# EAGLE design PIC18F2550 BOARD (EAGLE 7.1.0)
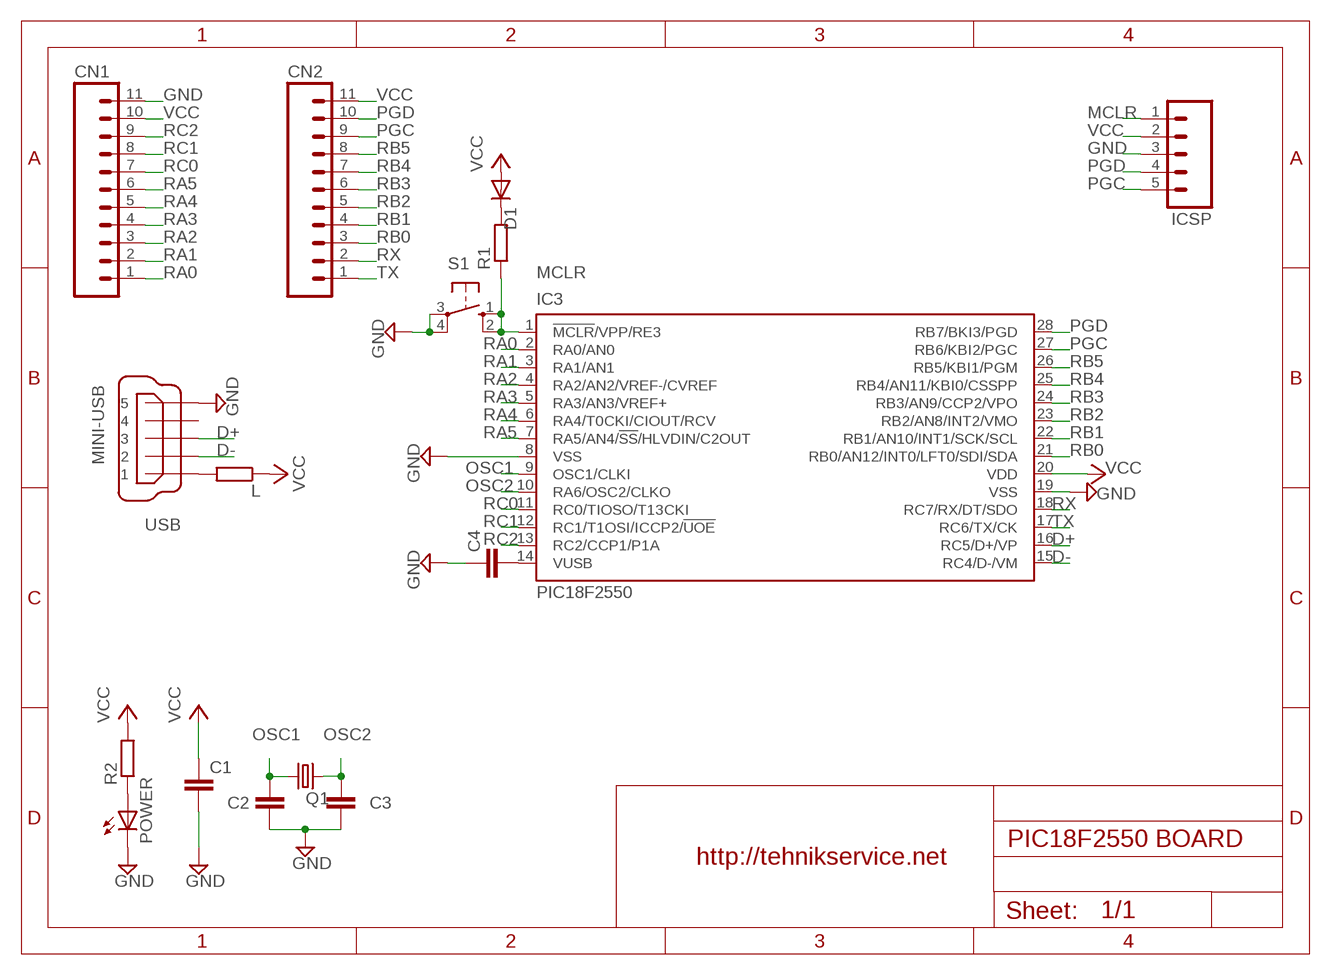
[diagram p0: schematic, sheet 1]

## Parts
C1  C-EUC0402  [C0402]
C2  C-EUC0402  [C0402]
C3  C-EUC0402  [C0402]
C4  C-EUC0402  [C0402]
CN1  M11  [11P]
CN2  M11  [11P]
D1  DIODE-DO214AC  [DO214AC]
IC3  PIC18F2550  PIC18F2550_28W  [SO28W]
ICSP  M05  [05P]
L  R-EU_R0402  [R0402]
POWER  LEDCHIP-LED0805  [CHIP-LED0805]
Q1  CRYSTALHC49S  [HC49/S]
R1  R-EU_R0402  [R0402]
R2  R-EU_R0402  [R0402]
S1  10-XX  [B3F-10XX]
USB  MINI-USB  MINI-USB-32005-201  [32005-201]

## Nets
D+: IC3.16(RC5/D+/VP) USB.3
D-: IC3.15(RC4/D-/VM) USB.2
GND: C1.2 C2.2 C3.2 C4.1 CN1.11 IC3.8(VSS) IC3.19(VSS) ICSP.3 POWER.C S1.3(P) S1.4(P1) USB.5
MCLR: IC3.1(!MCLR!/VPP/RE3) ICSP.1 R1.1 S1.1(S) S1.2(S1)
N$1: D1.C R1.2
N$2: POWER.A R2.1
N$3: C4.2 IC3.14(VUSB)
N$4: L.2 USB.1
OSC1: C2.1 IC3.9(OSC1/CLKI) Q1.1
OSC2: C3.1 IC3.10(RA6/OSC2/CLKO) Q1.2
PGC: CN2.9 IC3.27(RB6/KBI2/PGC) ICSP.5
PGD: CN2.10 IC3.28(RB7/BKI3/PGD) ICSP.4
RA0: CN1.1 IC3.2(RA0/AN0)
RA1: CN1.2 IC3.3(RA1/AN1)
RA2: CN1.3 IC3.4(RA2/AN2/VREF-/CVREF)
RA3: CN1.4 IC3.5(RA3/AN3/VREF+)
RA4: CN1.5 IC3.6(RA4/T0CKI/CIOUT/RCV)
RA5: CN1.6 IC3.7(RA5/AN4/!SS!/HLVDIN/C2OUT)
RB0: CN2.3 IC3.21(RB0/AN12/INT0/LFT0/SDI/SDA)
RB1: CN2.4 IC3.22(RB1/AN10/INT1/SCK/SCL)
RB2: CN2.5 IC3.23(RB2/AN8/INT2/VMO)
RB3: CN2.6 IC3.24(RB3/AN9/CCP2/VPO)
RB4: CN2.7 IC3.25(RB4/AN11/KBI0/CSSPP)
RB5: CN2.8 IC3.26(RB5/KBI1/PGM)
RC0: CN1.7 IC3.11(RC0/TIOSO/T13CKI)
RC1: CN1.8 IC3.12(RC1/T1OSI/ICCP2/!UOE)
RC2: CN1.9 IC3.13(RC2/CCP1/P1A)
RX: CN2.2 IC3.18(RC7/RX/DT/SDO)
TX: CN2.1 IC3.17(RC6/TX/CK)
VCC: C1.1 CN1.10 CN2.11 D1.A IC3.20(VDD) ICSP.2 L.1 R2.2
Unconnected: USB.4

## Notes on the sheet
- http://tehnikservice.net

## Library data of the parts
C1-C4 = rcl:C-EU: CAPACITOR, European symbol
CN1 CN2 = con-amp-quick:M11: AMP QUICK CONNECTOR; OC_FARNELL: unknown; OC_NEWARK: unknown
D1 = diode:DIODE-: DIODE
IC3 = microchip:PIC18F2*_28: USB Microcontrollers with nanoWatt Technology High-Performance, Enhanced Flash, 28/40/44-Pin, Source: http://ww1.microchip.com/downloads/en/devicedoc/39632c.pdf; MF: MICROCHIP; MPN: PIC18F2550-I/SO; OC_FARNELL: 9321268; OC_NEWARK: 73K1297
ICSP = con-amp-quick:M05: AMP QUICK CONNECTOR; OC_FARNELL: unknown; OC_NEWARK: unknown
L R1 R2 = rcl:R-EU_: RESISTOR, European symbol
POWER = led:LED: LED OSRAM: - CHIPLED LG R971, LG N971, LY N971, LG Q971, LY Q971, LO R971, LY R971 LH N974, LH R974 LS Q976, LO Q976, LY Q976 LO Q996 - Hyper CHIPLED LW Q18S LB Q993, LB Q99A, LB R99A - SideLED LS A670, LO A670, LY A670, LG A670, LP A670 LB A673, LV A673, LT A673, LW A673 LH A674 LY A675 LS A676, LA A676, LO A676, LY A676, LW A676 LS A679, LY A679, LG A679 - Hyper Micro SIDELED® LS Y876, LA Y876, LO Y876, LY Y876 LT Y87S - SmartLED LW L88C, LW L88S LB L89C, LB L89S, LG L890 LS L89K, LO L89K, LY L89K LS L896, LA L896, LO L896, LY L896 - TOPLED LS T670, LO T670, LY T670, LG T670, LP T670 LSG T670, LSP T670, LSY T670, LOP T670, LYG T670 LG T671, LOG T671, LSG T671 LB T673, LV T673, LT T673, LW T673 LH T674 LS T676, LA T676, LO T676, LY T676, LB T676, LH T676, LSB T676, LW T676 LB T67C, LV T67C, LT T67C, LS T67K, LO T67K, LY T67K, LW E67C LS E67B, LA E67B, LO E67B, LY E67B, LB E67C, LV E67C, LT E67C LW T67C LS T679, LY T679, LG T679 LS T770, LO T770, LY T770, LG T770, LP T770 LB T773, LV T773, LT T773, LW T773 LH T774 LS E675, LA E675, LY E675, LS T675 LS T776, LA T776, LO T776, LY T776, LB T776 LHGB T686 LT T68C, LB T68C - Hyper Mini TOPLED® LB M676 - Mini TOPLED Santana® LG M470 LS M47K, LO M47K, LY M47K Source: http://www.osram.convergy.de LUXEON: - LUMILED® LXK2-PW12-R00, LXK2-PW12-S00, LXK2-PW14-U00, LXK2-PW14-V00 LXK2-PM12-R00, LXK2-PM12-S00, LXK2-PM14-U00 LXK2-PE12-Q00, LXK2-PE12-R00, LXK2-PE12-S00, LXK2-PE14-T00, LXK2-PE14-U00 LXK2-PB12-K00, LXK2-PB12-L00, LXK2-PB12-M00, LXK2-PB14-N00, LXK2-PB14-P00, LXK2-PB14-Q00 LXK2-PR12-L00, LXK2-PR12-M00, LXK2-PR14-Q00, LXK2-PR14-R00 LXK2-PD12-Q00, LXK2-PD12-R00, LXK2-PD12-S00 LXK2-PH12-R00, LXK2-PH12-S00 LXK2-PL12-P00, LXK2-PL12-Q00, LXK2-PL12-R00 Source: www.luxeon.com KINGBRIGHT: KA-3528ASYC Source: www.kingbright.com
Q1 = crystal:CRYSTAL: CRYSTAL; OC_FARNELL: 1667008; OC_NEWARK: unknown
S1 = switch-omron:10-XX: OMRON SWITCH; MPN: B3F-1000; OC_FARNELL: 176432; OC_NEWARK: 36M3542
USB = con-cypressindustries:MINI-USB-: MINI USB-B Conector Source: www.cypressindustries.com; OC_FARNELL: unknown; OC_NEWARK: unknown

## Net classes
0 default: clearance 0.355 mm

## Board
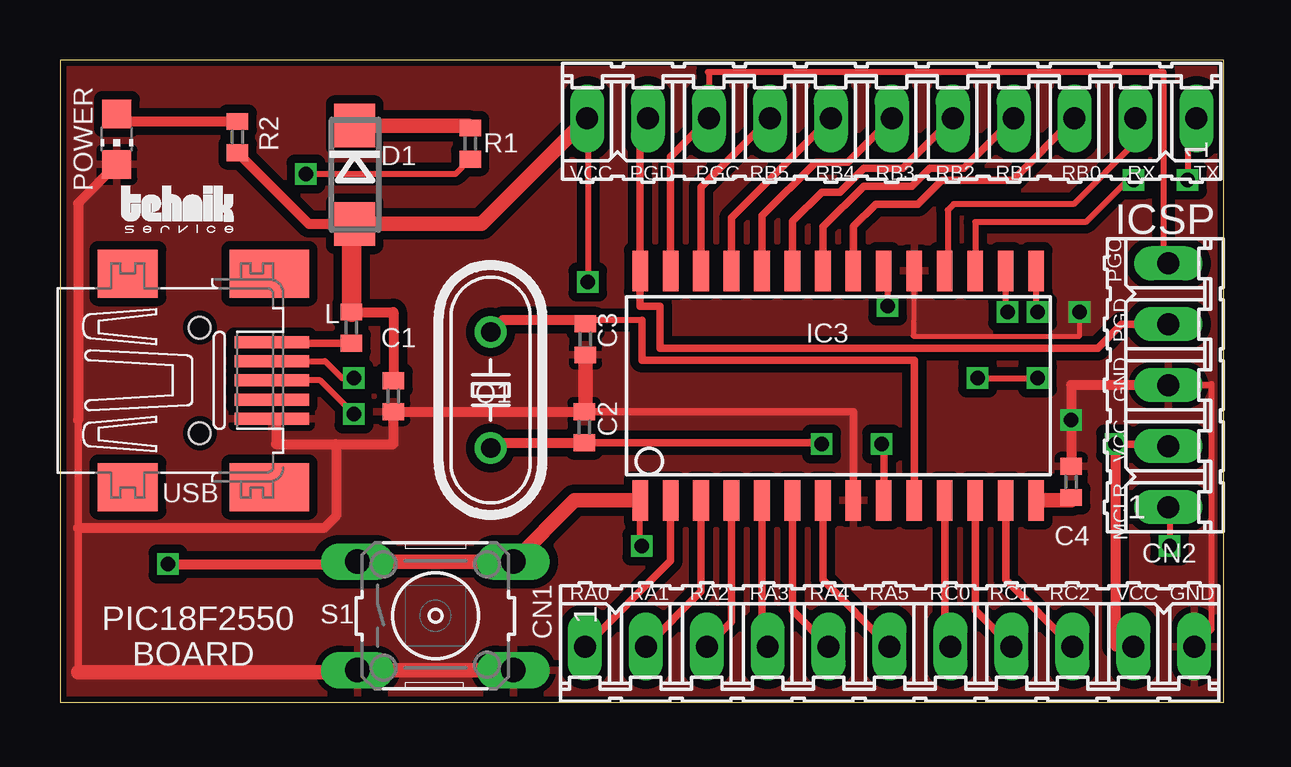
[diagram p1: board, top side]
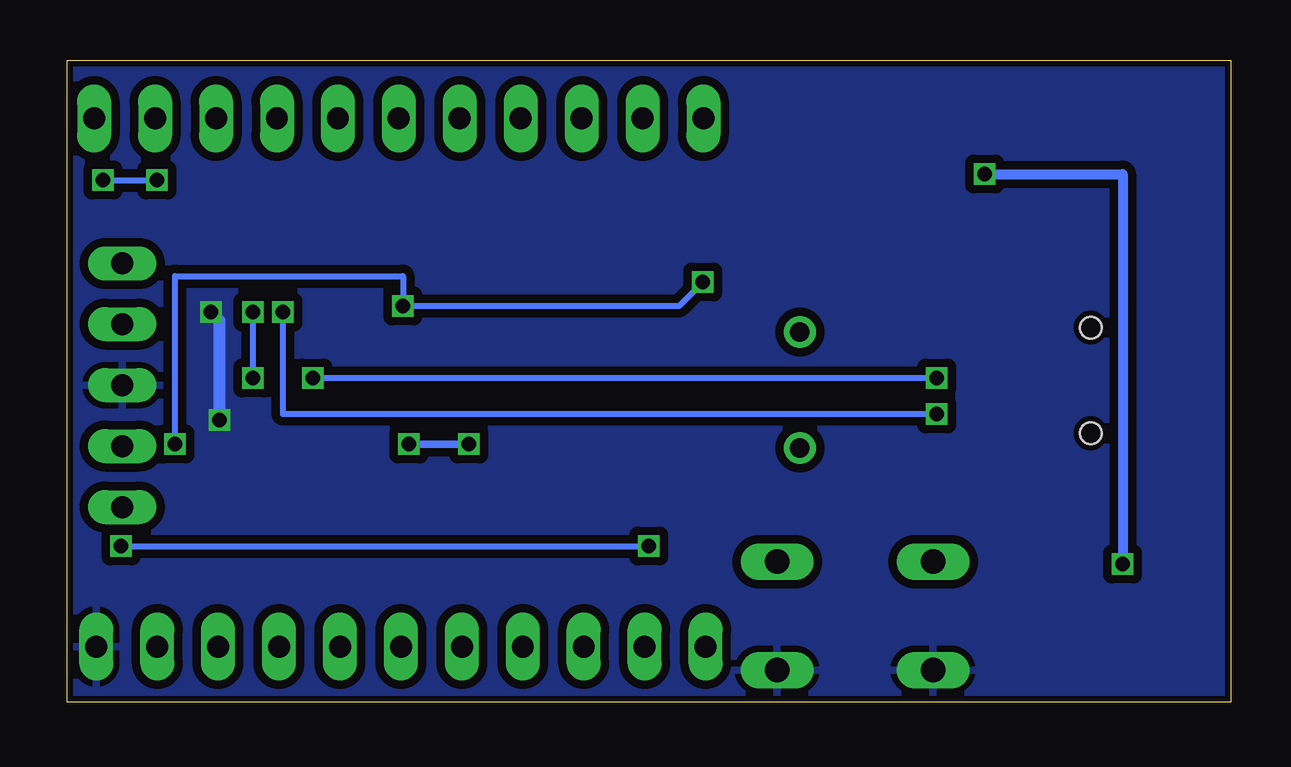
[diagram p2: board, bottom side, seen from below]

Size 48.5 x 26.75 mm. Coordinates in mm from the lower left corner, seen from the top.
Outline: 0,0 48.5,0 48.5,26.75 0,26.75 0,0
Copper layers (1*16): Top 0.035mm / dielectric 1.5mm / Bottom 0.035mm
Design rules "SeeedStudio_2layer_DRU_no_angle_20140221 *": minimum track width 6mil, minimum drill 12mil, track to track 12mil, track to pad 6mil, pad to pad 6mil, via to via 6mil, smd to smd 0mil, copper to edge 10mil, drill to drill 10mil, minimum pad ring 10mil, minimum via ring 6mil, stop-mask expansion 2mil, vias tented up to drill 100mil, thermal gap 10mil

### Footprints (pad centres in the part's own frame; a part is rotated, then mirrored left to right if it is on the bottom)
C0402 = smd 0.7 x 0.9: 1 -0.65,0; 2 0.65,0
11P = drill 0.914 long: 1 -12.7,0; 2 -10.16,0; 3 -7.62,0; 4 -5.08,0; 5 -2.54,0; 6 0,0; 7 2.54,0; 8 5.08,0; 9 7.62,0; 10 10.16,0; 11 12.7,0
DO214AC = smd 1.8 x 1.7: A 2.05,0; C -2.05,0
SO28W = smd 0.65 x 1.7: 1 -7.62,-4.78; 2 -6.35,-4.78; 3 -5.08,-4.78; 4 -3.81,-4.78; 5 -2.54,-4.78; 6 -1.27,-4.78; 7 0,-4.78; 8 1.27,-4.78; 9 2.54,-4.78; 10 3.81,-4.78; 11 5.08,-4.78; 12 6.35,-4.78; 13 7.62,-4.78; 14 8.89,-4.78; 15 8.89,4.78; 16 7.62,4.78; 17 6.35,4.78; 18 5.08,4.78; 19 3.81,4.78; 20 2.54,4.78; 21 1.27,4.78; 22 0,4.78; 23 -1.27,4.78; 24 -2.54,4.78; 25 -3.81,4.78; 26 -5.08,4.78; 27 -6.35,4.78; 28 -7.62,4.78
05P = drill 0.914 long: 1 -5.08,0; 2 -2.54,0; 3 0,0; 4 2.54,0; 5 5.08,0
R0402 = smd 0.7 x 0.9: 1 -0.65,0; 2 0.65,0
CHIP-LED0805 = smd 1.2 x 1.2: A 0,-1.05; C 0,1.05
HC49/S = drill 0.813: 1 -2.413,0; 2 2.413,0
B3F-10XX = drill 1.016 long: 1 -3.251,2.261; 2 3.251,2.261; 3 -3.251,-2.261; 4 3.251,-2.261
32005-201 = smd 3.1 x 0.5: 1 3,1.6; 2 3,0.8; 3 3,0; 4 3,-0.8; 5 3,-1.6 | smd 2.5 x 2: M1 -3,-4.45; M2 -3,4.45 | smd 3.3 x 2: M3 2.9,4.45; M4 2.9,-4.45 | hole 0.9: 0,2.2; 0,-2.2

### Placement (x,y rotation side)
C1  13.9,12.74 270 top
C2  21.85,11.45 90 top
C3  21.9,15.11 270 top
C4  42.15,9.17 270 top
CN1  34.58,2.31 0 top
CN2  34.67,24.32 180 top
D1  12.28,21.97 270 top
IC3  31.8,13.18 0 top
ICSP  46.2,13.2 90 top
L  12.15,15.6 270 top
POWER  2.37,23.45 180 top
Q1  17.95,13 90 top
R1  17.1,23.27 90 top
R2  7.4,23.54 270 top
S1  15.65,3.59 0 top
U$1  [LOGOT]  2.5,19.5 0 top
USB  5.83,13.4 0 top

### Tracks (layer width: path | path; a pad name or v marks a point on that pad's centre or on a via)
D+  (via drill 0.6)
  Top 0.254: v39.5,16.25 39.42,16.25 IC3.16 | v12.25,12 10.85,13.4 USB.3
  Bottom 0.254: v12.25,12 39.5,12 v39.5,16.25
D-  (via drill 0.6)
  Top 0.254: USB.2 11.05,14.2 11.75,13.5 v12.25,13.5 | v38.25,13.5 v40.75,13.5 | v40.75,16.25 40.69,16.25 IC3.15
  Bottom 0.254: v12.25,13.5 v38.25,13.5 | v40.75,13.5 v40.75,16.25
GND  (via drill 0.6)
  Top 0.2: IC3.19 35.57,15.25 42.5,15.25 v42.5,16.25
  Top 0.254: CN1.11 48,3.03 48,13.25 47.95,13.2 ICSP.3 | USB.5 9,11.8 9,10.75
  Top 0.305: 0.75,11.75 0.75,7.25 0.75,1.25 | C2.2 33.07,12.1 IC3.8
  Top 0.406: POWER.C 0.75,20.78 0.75,11.75 | USB.5 8.83,11.75 9,11.75 9,10.75 11.5,10.75 | 13.9,11.8 C1.2 | C1.2 C2.2 | ICSP.3 42.15,13.2 v42.15,11.75 C4.1 | 11.5,10.75 13.9,10.75 C1.2 | 11.5,10.75 11.5,7.75 11,7.25 0.75,7.25
  Top 0.61: S1.4 S1.3 12.4,1.25 0.75,1.25 | C2.2 21.9,12.15 C3.2
  Bottom 0.2: v42.5,16.25 42.15,15.9
  Bottom 0.5: 42.15,15.9 v42.15,11.75
  pour Top: 0,26.75 48.5,26.75 48.5,0 0,0
  pour Bottom: 0,26.75 48.5,26.75 48.5,0 0,0
MCLR  (via drill 0.6)
  Top 0.254: R1.1 16.48,22 v10.25,22 | ICSP.1 46.25,8.07 v46.25,6.5 | v24.25,6.5 24.18,6.57 IC3.1
  Top 0.406: v4.5,5.75 12.4,5.75 S1.1
  Top 0.61: S1.1 S1.2 21.45,8.4 IC3.1
  Bottom 0.254: v46.25,6.5 v24.25,6.5
  Bottom 0.406: v10.25,22 4.5,22 v4.5,5.75
N$1
  Top 0.61: D1.C 17,24.02 R1.2
N$2
  Top 0.406: POWER.A 2.68,24.19 R2.1
N$3
  Top 0.61: IC3.14 42.15,8.4 C4.2
N$4
  Top 0.305: L.2 8.88,14.95 USB.1
N$5
  pour Top: 0,26.75 48.5,26.75 48.5,0 0,0
OSC1  (via drill 0.6)
  Top 0.305: C2.1 31.75,10.8 v31.75,10.75 | v34.25,10.75 34.34,10.75 IC3.9
  Top 0.406: Q1.1 18.24,10.8 C2.1
  Bottom 0.305: v31.75,10.75 v34.25,10.75
OSC2
  Top 0.254: 24.25,15.91 22.05,15.91 arc90 C3.1
  Top 0.305: 24.25,15.91 24.25,14.25 35.61,14.25 IC3.10
  Top 0.406: C3.1 21.75,15.91 18.45,15.91 Q1.2
PGC
  Top 0.254: ICSP.5 46,18.48 46,26.25 27,26.25 27.05,26.2 CN2.9
  Top 0.305: CN2.9 25.45,22.72 IC3.27
PGD
  Top 0.305: CN2.10 24.18,23.99 IC3.28 24.18,16.5 25,16.5 25,14.75 43.25,14.75 44.24,15.74 ICSP.4
RA0
  Top 0.305: CN1.1 25.45,5.88 IC3.2
RA1
  Top 0.305: CN1.2 26.72,4.61 IC3.3
RA2
  Top 0.305: CN1.3 27.99,3.34 IC3.4
RA3
  Top 0.305: CN1.4 29.26,2.55 IC3.5
RA4
  Top 0.305: CN1.5 30.53,3.82 IC3.6
RA5
  Top 0.305: CN1.6 31.8,5.09 IC3.7
RB0
  Top 0.305: IC3.21 33.07,19.82 34,20.75 35.75,20.75 36.75,21.75 39.72,21.75 CN2.3
RB1
  Top 0.305: IC3.22 31.8,19.8 33.5,21.5 35.5,21.5 36.25,22.25 37.68,22.25 CN2.4
RB2
  Top 0.305: IC3.23 30.53,20.03 31.75,21.25 32.5,21.25 33.5,22.25 35.14,22.25 CN2.5
RB3
  Top 0.305: IC3.24 29.26,20.26 31.5,22.5 32.85,22.5 CN2.6
RB4
  Top 0.305: CN2.7 27.99,20.18 IC3.25
RB5
  Top 0.305: CN2.8 26.72,21.45 IC3.26
RC0
  Top 0.305: CN1.7 36.88,2.55 IC3.11
RC1
  Top 0.305: CN1.8 38.15,3.82 IC3.12
RC2
  Top 0.305: CN1.9 39.42,5.09 IC3.13
RX
  Top 0.254: CN2.2 44.83,23.33 42.25,20.75 37.25,20.75 37,20.5 37,18.08 IC3.18
TX  (via drill 0.6)
  Top 0.254: CN2.1 47,23.95 v47,21.75 | v44.75,21.75 44.5,21.75 42.75,20 38.15,20 IC3.17
  Bottom 0.254: v47,21.75 v44.75,21.75
VCC  (via drill 0.6)
  Top 0.254: 34.5,18.25 34.5,18.12 IC3.20 arc-90 34.5,17.8 v34.5,16.5 | CN2.11 22,24.29 v22,17.5
  Top 0.305: v44,10.75 46.11,10.75 ICSP.2
  Top 0.406: R2.2 10.37,19.92 D1.A | L.1 13.9,16.25 C1.1 | CN1.10 44,2.31 v44,10.75
  Top 0.61: CN2.11 17.57,19.92 D1.A
  Top 0.813: D1.A 12.15,19.79 L.1
  Bottom 0.254: v22,17.5 23,16.5 v34.5,16.5 34.5,17.75 44,17.75 v44,10.75

### Text on the board
tPlace: VCC | PGD | PGC | RB5 | RB4 | RB3 | RB2 | RB1 | RB0 | RX | TX | PGC | PGD | GND | VCC | MCLR | PIC18F2550 | RA0 | RA1 | RA2 | RA3 | RA4 | RA5 | RC0 | RC1 | RC2 | VCC | GND | BOARD